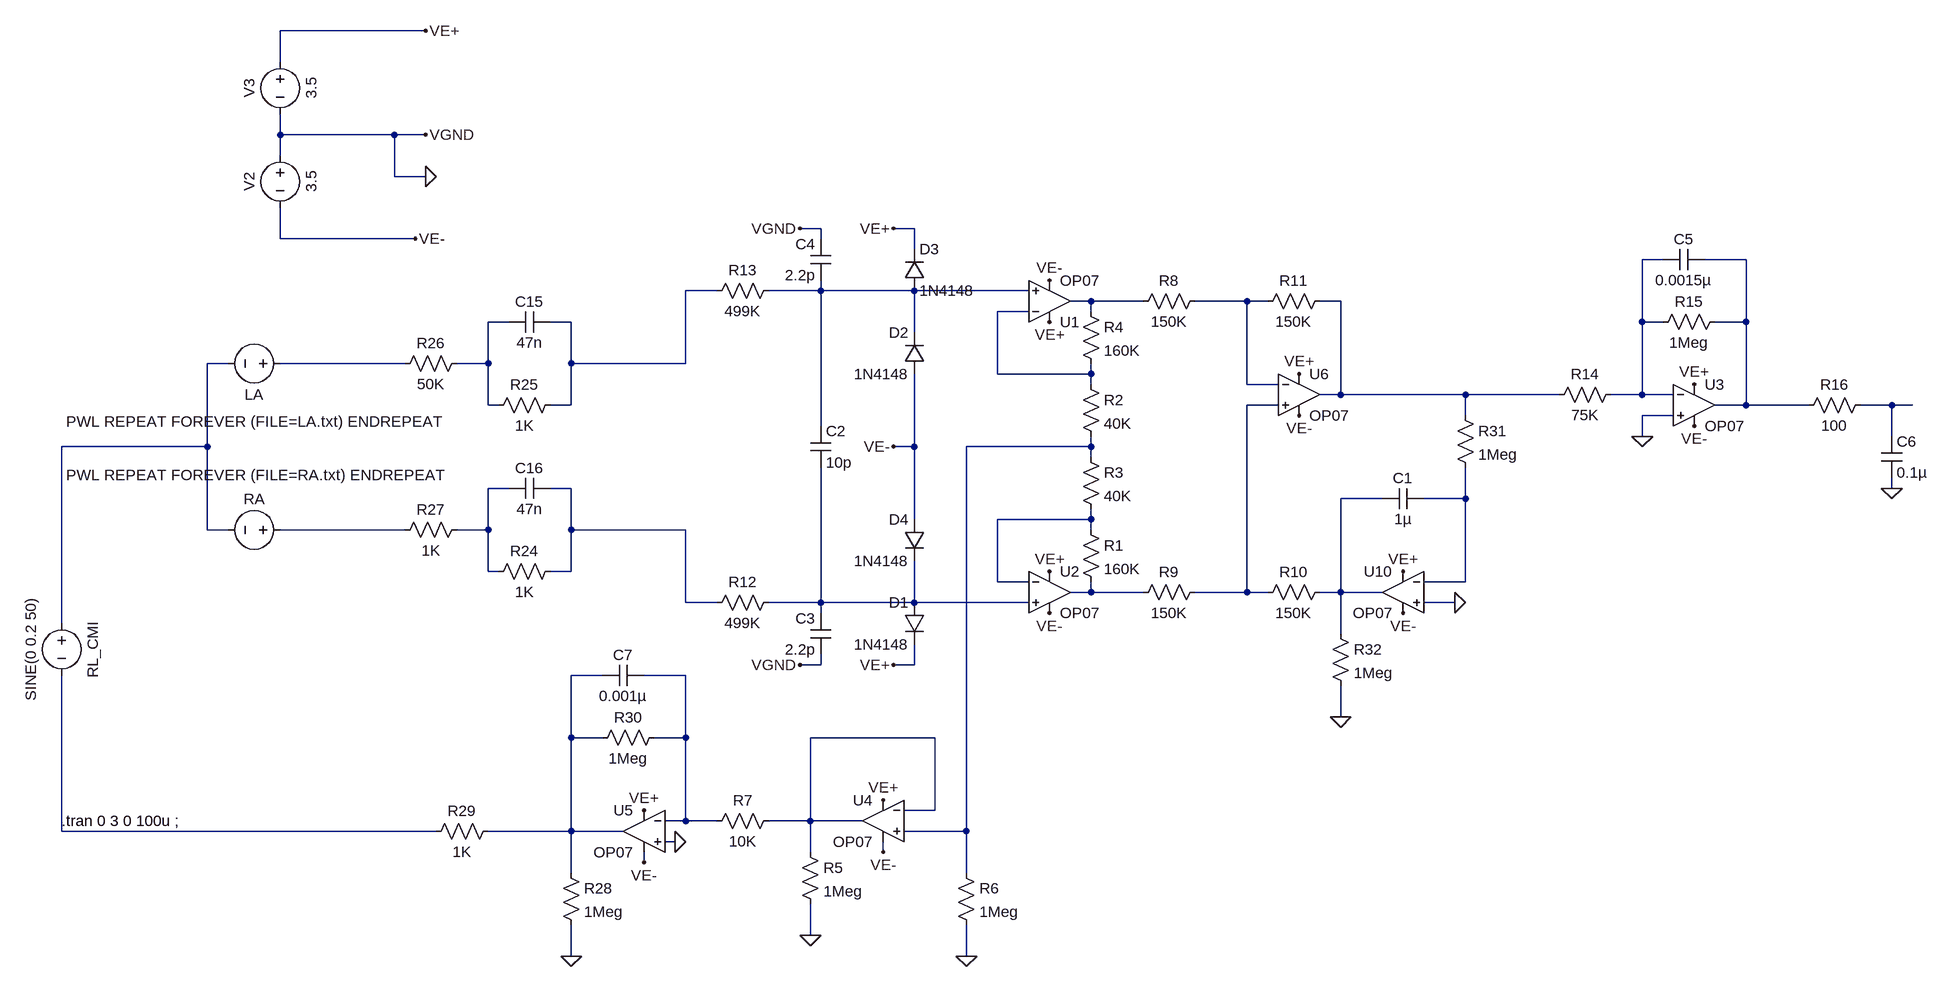
[diagram p0: schematic ECG_AUDIO_OUT.asc]
ECG_AUDIO_OUT.asc, the LTspice schematic file:
Version 4.1
SHEET 1 2760 1056
WIRE -896 -432 -1120 -432
WIRE -1120 -384 -1120 -432
WIRE -1120 -272 -1120 -304
WIRE -944 -272 -1120 -272
WIRE -896 -272 -944 -272
WIRE -1120 -240 -1120 -272
WIRE -944 -208 -944 -272
WIRE -896 -208 -944 -208
WIRE -288 -128 -320 -128
WIRE -144 -128 -176 -128
WIRE -1120 -112 -1120 -160
WIRE -912 -112 -1120 -112
WIRE -288 -112 -288 -128
WIRE -144 -96 -144 -128
WIRE 1008 -80 976 -80
WIRE 1136 -80 1072 -80
WIRE -448 -32 -496 -32
WIRE -288 -32 -288 -48
WIRE -288 -32 -368 -32
WIRE -144 -32 -288 -32
WIRE 32 -32 -144 -32
WIRE 128 -16 96 -16
WIRE 208 -16 128 -16
WIRE 368 -16 288 -16
WIRE 400 -16 368 -16
WIRE 512 -16 480 -16
WIRE 32 0 -16 0
WIRE 128 0 128 -16
WIRE -768 16 -800 16
WIRE -672 16 -704 16
WIRE 976 16 976 -80
WIRE 1008 16 976 16
WIRE 1136 16 1136 -80
WIRE 1136 16 1088 16
WIRE -144 32 -144 -32
WIRE -1200 80 -1232 80
WIRE -928 80 -1120 80
WIRE -800 80 -800 16
WIRE -800 80 -848 80
WIRE -672 80 -672 16
WIRE -496 80 -496 -32
WIRE -496 80 -672 80
WIRE -16 96 -16 0
WIRE 128 96 128 80
WIRE 128 96 -16 96
WIRE 128 112 128 96
WIRE 368 112 368 -16
WIRE 416 112 368 112
WIRE 512 128 512 -16
WIRE 512 128 480 128
WIRE 704 128 512 128
WIRE 848 128 704 128
WIRE 976 128 976 16
WIRE 976 128 928 128
WIRE 1024 128 976 128
WIRE -800 144 -800 80
WIRE -784 144 -800 144
WIRE -672 144 -672 80
WIRE -672 144 -704 144
WIRE 416 144 368 144
WIRE 1136 144 1136 16
WIRE 1136 144 1088 144
WIRE 1232 144 1136 144
WIRE 1360 144 1312 144
WIRE 1392 144 1360 144
WIRE 704 160 704 128
WIRE 1024 160 976 160
WIRE -288 176 -288 -32
WIRE 976 192 976 160
WIRE 1360 192 1360 144
WIRE -1232 208 -1232 80
WIRE -1232 208 -1456 208
WIRE -144 208 -144 96
WIRE -144 208 -176 208
WIRE 128 208 128 192
WIRE 128 208 -64 208
WIRE 128 224 128 208
WIRE -768 272 -800 272
WIRE -672 272 -704 272
WIRE 1360 272 1360 256
WIRE 576 288 512 288
WIRE 704 288 704 240
WIRE 704 288 640 288
WIRE -144 320 -144 208
WIRE 128 320 128 304
WIRE 128 320 -16 320
WIRE -1232 336 -1232 208
WIRE -1200 336 -1232 336
WIRE -928 336 -1120 336
WIRE -800 336 -800 272
WIRE -800 336 -848 336
WIRE -672 336 -672 272
WIRE -496 336 -672 336
WIRE 128 336 128 320
WIRE -800 400 -800 336
WIRE -784 400 -800 400
WIRE -672 400 -672 336
WIRE -672 400 -704 400
WIRE -16 416 -16 320
WIRE 32 416 -16 416
WIRE 704 416 704 288
WIRE 704 416 640 416
WIRE 128 432 128 416
WIRE 128 432 96 432
WIRE 208 432 128 432
WIRE 368 432 368 144
WIRE 368 432 288 432
WIRE 400 432 368 432
WIRE 512 432 512 288
WIRE 512 432 480 432
WIRE 576 432 512 432
WIRE -496 448 -496 336
WIRE -448 448 -496 448
WIRE -288 448 -288 240
WIRE -288 448 -368 448
WIRE -144 448 -144 384
WIRE -144 448 -288 448
WIRE 32 448 -144 448
WIRE 688 448 640 448
WIRE -288 464 -288 448
WIRE -1456 480 -1456 208
WIRE 512 496 512 432
WIRE -288 544 -288 528
WIRE -288 544 -320 544
WIRE -144 544 -144 512
WIRE -144 544 -176 544
WIRE -624 560 -672 560
WIRE -496 560 -560 560
WIRE 512 624 512 576
WIRE -672 656 -672 560
WIRE -624 656 -672 656
WIRE -496 656 -496 560
WIRE -496 656 -544 656
WIRE -112 656 -304 656
WIRE -112 768 -112 656
WIRE -112 768 -160 768
WIRE -496 784 -496 656
WIRE -496 784 -528 784
WIRE -448 784 -496 784
WIRE -304 784 -304 656
WIRE -304 784 -368 784
WIRE -224 784 -304 784
WIRE -1456 800 -1456 560
WIRE -880 800 -1456 800
WIRE -672 800 -672 656
WIRE -672 800 -800 800
WIRE -592 800 -672 800
WIRE -64 800 -64 208
WIRE -64 800 -160 800
WIRE -512 816 -528 816
WIRE -304 832 -304 784
WIRE -192 832 -192 816
WIRE -560 848 -560 832
WIRE -672 864 -672 800
WIRE -64 864 -64 800
WIRE -304 960 -304 912
WIRE -672 992 -672 944
WIRE -64 992 -64 944
FLAG -320 -128 VGND
FLAG -320 544 VGND
FLAG -176 208 VE-
FLAG -176 -128 VE+
FLAG -176 544 VE+
FLAG 64 400 VE+
FLAG 64 16 VE+
FLAG 448 96 VE+
FLAG -896 -432 VE+
FLAG -896 -272 VGND
FLAG -912 -112 VE-
FLAG -896 -208 0
FLAG -304 960 0
FLAG -64 992 0
FLAG -672 992 0
FLAG 512 624 0
FLAG 688 448 0
FLAG 608 400 VE+
FLAG -512 816 0
FLAG -192 752 VE+
FLAG -560 768 VE+
FLAG -560 848 VE-
FLAG -192 832 VE-
FLAG 64 464 VE-
FLAG 64 -48 VE-
FLAG 448 160 VE-
FLAG 608 464 VE-
FLAG 976 192 0
FLAG 1360 272 0
FLAG 1056 176 VE-
FLAG 1056 112 VE+
SYMBOL OpAmps\\OP07 64 48 M180
SYMATTR InstName U1
SYMBOL OpAmps\\OP07 64 368 R0
SYMATTR InstName U2
SYMBOL res 112 320 R0
SYMATTR InstName R1
SYMATTR Value 160K
SYMBOL res 112 -16 R0
SYMATTR InstName R4
SYMATTR Value 160K
SYMBOL res 304 -32 R90
WINDOW 0 0 56 VBottom 2
WINDOW 3 32 56 VTop 2
SYMATTR InstName R8
SYMATTR Value 150K
SYMBOL res 304 416 R90
WINDOW 0 0 56 VBottom 2
WINDOW 3 32 56 VTop 2
SYMATTR InstName R9
SYMATTR Value 150K
SYMBOL res 496 416 R90
WINDOW 0 0 56 VBottom 2
WINDOW 3 32 56 VTop 2
SYMATTR InstName R10
SYMATTR Value 150K
SYMBOL res 496 -32 R90
WINDOW 0 0 56 VBottom 2
WINDOW 3 32 56 VTop 2
SYMATTR InstName R11
SYMATTR Value 150K
SYMBOL OpAmps\\OP07 448 64 R0
SYMATTR InstName U6
SYMBOL res -352 432 R90
WINDOW 0 0 56 VBottom 2
WINDOW 3 32 56 VTop 2
SYMATTR InstName R12
SYMATTR Value 499K
SYMBOL res -352 -48 R90
WINDOW 0 0 56 VBottom 2
WINDOW 3 32 56 VTop 2
SYMATTR InstName R13
SYMATTR Value 499K
SYMBOL voltage -1104 80 M270
WINDOW 0 -32 56 VBottom 2
WINDOW 3 -89 56 VCenter 2
WINDOW 123 0 0 Left 0
WINDOW 39 0 0 Left 0
SYMATTR InstName LA
SYMATTR Value PWL REPEAT FOREVER (FILE=LA.txt) ENDREPEAT
SYMBOL voltage -1104 336 R90
WINDOW 0 -32 56 VBottom 2
WINDOW 3 -69 54 VBottom 2
WINDOW 123 0 0 Left 0
WINDOW 39 0 0 Left 0
SYMATTR InstName RA
SYMATTR Value PWL REPEAT FOREVER (FILE=RA.txt) ENDREPEAT
SYMBOL voltage -1456 464 R0
WINDOW 0 32 56 VTop 2
WINDOW 3 -32 56 VBottom 2
WINDOW 123 0 0 Left 0
WINDOW 39 0 0 Left 0
SYMATTR InstName RL_CMI
SYMATTR Value SINE(0 0.2 50)
SYMBOL diode -128 448 M0
SYMATTR InstName D1
SYMATTR Value 1N4148
SYMBOL cap -304 176 R0
SYMATTR InstName C2
SYMATTR Value 10p
SYMBOL cap -272 464 M0
SYMATTR InstName C3
SYMATTR Value 2.2p
SYMBOL cap -272 -112 M0
SYMATTR InstName C4
SYMATTR Value 2.2p
SYMBOL voltage -1120 -256 R0
WINDOW 0 -32 56 VBottom 2
WINDOW 3 32 56 VTop 2
WINDOW 123 0 0 Left 0
WINDOW 39 0 0 Left 0
SYMATTR InstName V2
SYMATTR Value 3.5
SYMBOL voltage -1120 -400 R0
WINDOW 0 -32 56 VBottom 2
WINDOW 3 32 56 VTop 2
WINDOW 123 0 0 Left 0
WINDOW 39 0 0 Left 0
SYMATTR InstName V3
SYMATTR Value 3.5
SYMBOL cap -704 0 R90
WINDOW 0 0 32 VBottom 2
WINDOW 3 32 32 VTop 2
SYMATTR InstName C15
SYMATTR Value 47n
SYMBOL cap -704 256 R90
WINDOW 0 0 32 VBottom 2
WINDOW 3 32 32 VTop 2
SYMATTR InstName C16
SYMATTR Value 47n
SYMBOL res -688 384 R90
WINDOW 0 0 56 VBottom 2
WINDOW 3 32 56 VTop 2
SYMATTR InstName R24
SYMATTR Value 1K
SYMBOL res -688 128 R90
WINDOW 0 0 56 VBottom 2
WINDOW 3 32 56 VTop 2
SYMATTR InstName R25
SYMATTR Value 1K
SYMBOL res -832 64 R90
WINDOW 0 0 56 VBottom 2
WINDOW 3 32 56 VTop 2
SYMATTR InstName R26
SYMATTR Value 50K
SYMBOL res -832 320 R90
WINDOW 0 0 56 VBottom 2
WINDOW 3 32 56 VTop 2
SYMATTR InstName R27
SYMATTR Value 1K
SYMBOL diode -160 -32 M180
WINDOW 0 24 64 Left 2
WINDOW 3 24 0 Left 2
SYMATTR InstName D3
SYMATTR Value 1N4148
SYMBOL diode -128 96 R180
WINDOW 0 24 64 Left 2
WINDOW 3 24 0 Left 2
SYMATTR InstName D2
SYMATTR Value 1N4148
SYMBOL diode -128 320 M0
SYMATTR InstName D4
SYMATTR Value 1N4148
SYMBOL res 112 96 R0
SYMATTR InstName R2
SYMATTR Value 40K
SYMBOL res 112 208 R0
SYMATTR InstName R3
SYMATTR Value 40K
SYMBOL OpAmps\\OP07 -192 720 M0
SYMATTR InstName U4
SYMBOL OpAmps\\OP07 -560 736 M0
SYMATTR InstName U5
SYMBOL res -320 816 R0
SYMATTR InstName R5
SYMATTR Value 1Meg
SYMBOL res -80 848 R0
SYMATTR InstName R6
SYMATTR Value 1Meg
SYMBOL res -352 768 R90
WINDOW 0 0 56 VBottom 2
WINDOW 3 32 56 VTop 2
SYMATTR InstName R7
SYMATTR Value 10K
SYMBOL res -688 848 R0
SYMATTR InstName R28
SYMATTR Value 1Meg
SYMBOL res -784 784 R90
WINDOW 0 0 56 VBottom 2
WINDOW 3 32 56 VTop 2
SYMATTR InstName R29
SYMATTR Value 1K
SYMBOL res -528 640 R90
WINDOW 0 0 56 VBottom 2
WINDOW 3 32 56 VTop 2
SYMATTR InstName R30
SYMATTR Value 1Meg
SYMBOL OpAmps\\OP07 608 368 M0
SYMATTR InstName U10
SYMBOL cap 640 272 R90
WINDOW 0 0 32 VBottom 2
WINDOW 3 32 32 VTop 2
SYMATTR InstName C1
SYMATTR Value 1µ
SYMBOL res 688 144 R0
SYMATTR InstName R31
SYMATTR Value 1Meg
SYMBOL res 496 480 R0
SYMATTR InstName R32
SYMATTR Value 1Meg
SYMBOL res 944 112 R90
WINDOW 0 0 56 VBottom 2
WINDOW 3 32 56 VTop 2
SYMATTR InstName R14
SYMATTR Value 75K
SYMBOL OpAmps\\OP07 1056 80 R0
SYMATTR InstName U3
SYMBOL res 1104 0 R90
WINDOW 0 0 56 VBottom 2
WINDOW 3 32 56 VTop 2
SYMATTR InstName R15
SYMATTR Value 1Meg
SYMBOL cap 1072 -96 R90
WINDOW 0 0 32 VBottom 2
WINDOW 3 32 32 VTop 2
SYMATTR InstName C5
SYMATTR Value 0.0015µ
SYMBOL res 1328 128 R90
WINDOW 0 0 56 VBottom 2
WINDOW 3 32 56 VTop 2
SYMATTR InstName R16
SYMATTR Value 100
SYMBOL cap 1344 192 R0
SYMATTR InstName C6
SYMATTR Value 0.1µ
SYMBOL cap -560 544 R90
WINDOW 0 0 32 VBottom 2
WINDOW 3 32 32 VTop 2
SYMATTR InstName C7
SYMATTR Value 0.001µ
TEXT -1456 784 Left 2 !.tran 0 3 0 100u ;

The netlist it stands for:
* ECG_AUDIO_OUT.asc
X§U1 N004 N008 VE+ VE- N005 LT1001  ; OP07, pins In+ In- V+ V- OUT
X§U2 N022 N019 VE+ VE- N021 LT1001  ; OP07, pins In+ In- V+ V- OUT
R1 N019 N021 160K
R4 N005 N008 160K
R8 N006 N005 150K
R9 N012 N021 150K
R10 N017 N012 150K
R11 N007 N006 150K
X§U6 N012 N006 VE+ VE- N007 LT1001  ; OP07, pins In+ In- V+ V- OUT
R12 N022 N016 499K
R13 N004 N003 499K
V§LA N011 N010 PWL REPEAT FOREVER (FILE=LA.txt) ENDREPEAT
V§RA N020 N010 PWL REPEAT FOREVER (FILE=RA.txt) ENDREPEAT
V§RL_CMI N010 N026 SINE(0 0.2 50)
D1 N022 VE+ 1N4148
C2 N004 N022 10p
C3 N022 0 2.2p
C4 0 N004 2.2p
V2 0 VE- 3.5
V3 VE+ 0 3.5
C15 N003 N009 47n
C16 N016 N015 47n
R24 N016 N015 1K
R25 N003 N009 1K
R26 N009 N011 50K
R27 N015 N020 1K
D3 N004 VE+ 1N4148
D2 VE- N004 1N4148
D4 VE- N022 1N4148
R2 N008 N014 40K
R3 N014 N019 40K
X§U4 N014 N025 VE+ VE- N025 LT1001  ; OP07, pins In+ In- V+ V- OUT
X§U5 0 N024 VE+ VE- N023 LT1001  ; OP07, pins In+ In- V+ V- OUT
R5 N025 0 1Meg
R6 N014 0 1Meg
R7 N025 N024 10K
R28 N023 0 1Meg
R29 N023 N026 1K
R30 N024 N023 1Meg
X§U10 0 N018 VE+ VE- N017 LT1001  ; OP07, pins In+ In- V+ V- OUT
C1 N018 N017 1µ
R31 N007 N018 1Meg
R32 N017 0 1Meg
R14 N001 N007 75K
X§U3 0 N001 VE+ VE- N002 LT1001  ; OP07, pins In+ In- V+ V- OUT
R15 N002 N001 1Meg
C5 N002 N001 0.0015µ
R16 N013 N002 100
C6 N013 0 0.1µ
C7 N024 N023 0.001µ
.model D D
.lib standard.dio
.tran 0 3 0 100u ;
.lib LTC.lib
.backanno
.end